# Altium schematic sheet Connectors.SchDoc: Connectors
size OrCAD A; Date: Not used; ApprovedBy: Not used; CheckedBy: Not used; Author: Not used; CompanyName: STMicroelectronics; DrawnBy: Not used; Engineer: Not used; Organization: Not used; Address1: Not used; Address2: Not used; Address3: Not used; Address4: Not used; DocumentNumber: 5; Revision: Not used; SheetNumber: 5; SheetTotal: 9; CurrentTime: Not used; CurrentDate: Not used; Time: Not used; DocumentFullPathAndName: Not used; DocumentName: Not used; ModifiedDate: Not used; ImagePath: Not used; ProjectName: Not used; Application_BuildNumber: Not used
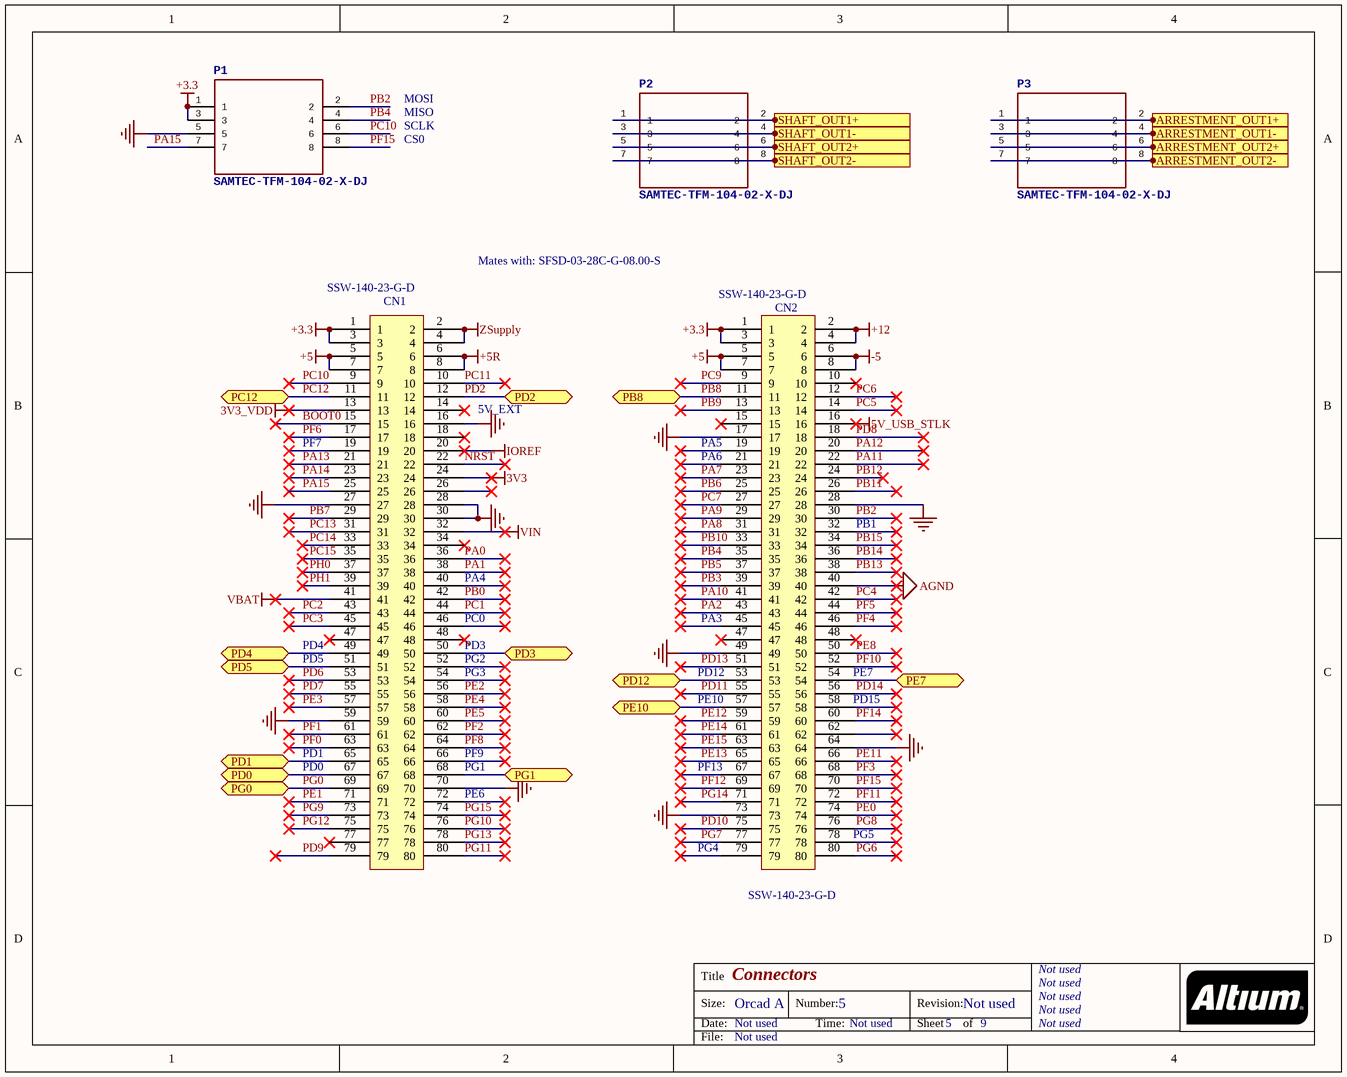
[diagram p0: Connectors.SchDoc]

## Parts
CN1  SSW-140-23-G-D  [SSW-140-23-G-D]
CN2  SSW-140-23-G-D  [SSW-140-23-G-D]
P1  SAMTEC-TFM-104-02-X-DJ  [SAMTEC-TFM-104-02-X-D]
P2  SAMTEC-TFM-104-02-X-DJ  [SAMTEC-TFM-104-02-X-D]
P3  SAMTEC-TFM-104-02-X-DJ  [SAMTEC-TFM-104-02-X-D]

## Ports
ARRESTMENT_OUT1+, ARRESTMENT_OUT1-, ARRESTMENT_OUT2+, ARRESTMENT_OUT2-, PB8, PC12, PD0, PD1, PD2, PD3, PD4, PD5, PD12, PE7, PE10, PG0, PG1, SHAFT_OUT1+, SHAFT_OUT1-, SHAFT_OUT2+, SHAFT_OUT2-

## Nets
3V3: CN1.24
3V3_VDD: CN1.13
5V_USB_STLK: CN2.16
+3.3: CN1.1 CN1.3 CN2.1 CN2.3 P1.1 P1.3
+5: CN1.5 CN1.7 CN2.5 CN2.7
+5R: CN1.6 CN1.8
+12: CN2.2 CN2.4
-5: CN2.6 CN2.8
AGND: CN2.40
GND: CN1.16 CN1.27 CN1.28 CN1.30 CN1.59 CN1.70 CN2.17 CN2.28 CN2.49 CN2.64 CN2.73 P1.5
IOREF: CN1.20
VBAT: CN1.41
VIN: CN1.32
ZSupply: CN1.2 CN1.4
ARRESTMENT_OUT1+: P3.1 P3.2 ; port ARRESTMENT_OUT1+
ARRESTMENT_OUT1-: P3.3 P3.4 ; port ARRESTMENT_OUT1-
ARRESTMENT_OUT2+: P3.5 P3.6 ; port ARRESTMENT_OUT2+
ARRESTMENT_OUT2-: P3.7 P3.8 ; port ARRESTMENT_OUT2-
BOOT0: CN1.15
NRST: CN1.22
PA0: CN1.36
PA1: CN1.38
PA2: CN2.43
PA7: CN2.23
PA8: CN2.31
PA9: CN2.29
PA10: CN2.41
PA11: CN2.22
PA12: CN2.20
PA13: CN1.21
PA14: CN1.23
PA15: CN1.25 P1.7
PB0: CN1.42
PB2: CN2.30 P1.2
PB3: CN2.39
PB4: CN2.35 P1.4
PB5: CN2.37
PB6: CN2.25
PB7: CN1.29
PB8: CN2.11 ; port PB8
PB9: CN2.13
PB10: CN2.33
PB11: CN2.26
PB12: CN2.24
PB13: CN2.38
PB14: CN2.36
PB15: CN2.34
PC1: CN1.44
PC2: CN1.43
PC3: CN1.45
PC4: CN2.42
PC5: CN2.14
PC6: CN2.12
PC7: CN2.27
PC9: CN2.9
PC10: CN1.9 P1.6
PC11: CN1.10
PC12: CN1.11 ; port PC12
PC13: CN1.31
PC14: CN1.33
PC15: CN1.35
PD0: CN1.67 ; port PD0
PD1: CN1.65 ; port PD1
PD2: CN1.12 ; port PD2
PD3: CN1.50 ; port PD3
PD4: CN1.49 ; port PD4
PD5: CN1.51 ; port PD5
PD6: CN1.53
PD7: CN1.55
PD8: CN2.18
PD9: CN1.79
PD10: CN2.75
PD11: CN2.55
PD12: CN2.53 ; port PD12
PD13: CN2.51
PD14: CN2.56
PE0: CN2.74
PE1: CN1.71
PE2: CN1.56
PE3: CN1.57
PE4: CN1.58
PE5: CN1.60
PE7: CN2.54 ; port PE7
PE8: CN2.50
PE10: CN2.57 ; port PE10
PE11: CN2.66
PE12: CN2.59
PE13: CN2.65
PE14: CN2.61
PE15: CN2.63
PF0: CN1.63
PF1: CN1.61
PF2: CN1.62
PF3: CN2.68
PF4: CN2.46
PF5: CN2.44
PF6: CN1.17
PF8: CN1.64
PF10: CN2.52
PF11: CN2.72
PF12: CN2.69
PF14: CN2.60
PF15: CN2.70 P1.8
PG0: CN1.69 ; port PG0
PG1: CN1.68 ; port PG1
PG6: CN2.80
PG7: CN2.77
PG8: CN2.76
PG9: CN1.73
PG10: CN1.76
PG11: CN1.80
PG12: CN1.75
PG13: CN1.78
PG14: CN2.71
PG15: CN1.74
PH0: CN1.37
PH1: CN1.39
SHAFT_OUT1+: P2.1 P2.2 ; port SHAFT_OUT1+
SHAFT_OUT1-: P2.3 P2.4 ; port SHAFT_OUT1-
SHAFT_OUT2+: P2.5 P2.6 ; port SHAFT_OUT2+
SHAFT_OUT2-: P2.7 P2.8 ; port SHAFT_OUT2-

Not connected (* = marked no-connect by the designer): CN1 14* 18* 19* 26* 34* 40* 46* 47* 48* 52* 54* 66* 72* 77*; CN2 10* 15* 19* 21* 32* 45* 47* 48* 58* 62* 67* 78* 79*

## Notes on the sheet
- MOSI
- MISO
- SCLK
- CS0
- Mates with: SFSD-03-28C-G-08.00-S
- 5V_EXT
- (near CN1) PF7
- (near CN2) PA6
- (near CN2) PA5
- (near CN2) PB1
- (near CN1) PA4
- (near CN1) PC0
- (near CN2) PA3
- (near CN1) PD4
- (near CN1) PD5
- (near CN1) PG2
- (near CN1) PG3
- (near CN1) PD3
- (near CN2) PD12
- (near CN2) PE7
- (near CN1) PD1
- (near CN1) PF9
- (near CN2) PE10
- (near CN2) PD15
- (near CN1) PD0
- (near CN1) PE6
- (near CN1) PG1
- (near CN2) PF13
- (near CN2) PG4
- (near CN2) PG5
- Title
- Size:
- Date:
- Orcad A
- Number:
- Time:
- Revision:
- Sheet
- of
- File:

## Library data of the parts
CN1 CN2 = SSW-140-23-G-D: 80 Position Receptacle Connector Through Hole; Manufacturer: Samtec; Number of Contacts: 80; Gender: Female; Pitch: 2.54mm; Supplier 1: Avnet; Supplier Part Number 1: SSW-140-23-G-D; Manufacturer Part Number: SSW-140-23-G-D; Stock 1: 0; Pricing 1: 1=13.99000, 10=13.29000, 25=12.59000, 50=12.09000, 100=11.29000 (USD); RoHS: Yes; Mount: Through Hole; Contact Plating: Gold; Number of Rows: 2; Packaging: Bulk; Termination: Solder; Radiation Hardening: No; ComponentLink1URL: http://www.samtec.com/documents/webfiles/pdf/SSQ_TH.PDF?src-supplier=Avnet; ComponentLink1Description: http://www.samtec.com/documents/webfiles/pdf/SSQ_TH.PDF?src-supplier=Avnet